# Altium schematic sheet CON_LCD_INDF.SchDoc: TFT LCD Header
size A4; Organization: Altium Limited.; Address1: Level 3, 12a Rodborough Rd; Address2: Frenchs Forest 2086; Address3: NSW; Address4: AUSTRALIA; Revision: 6; SheetNumber: 48; SheetTotal: 64
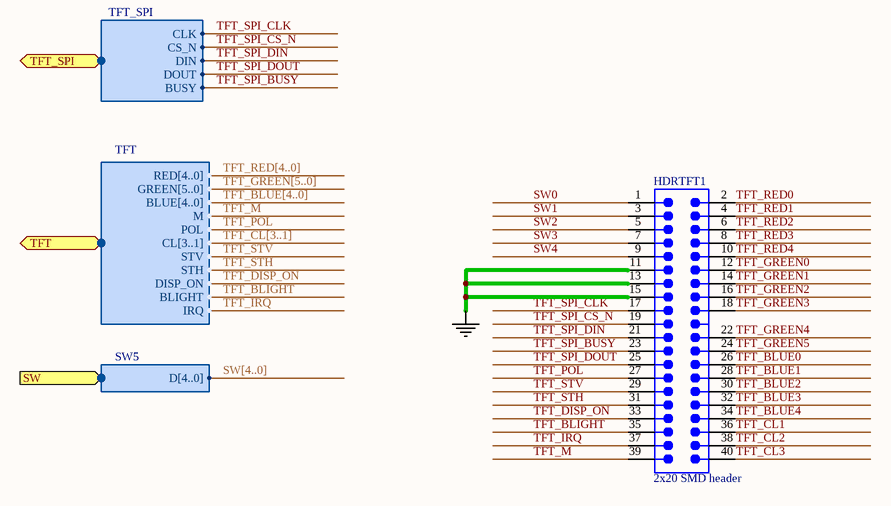
[diagram p0: CON_LCD_INDF.SchDoc]

## Parts
HDRTFT1  2x20 SMD header  [HDR2X20_SMT]

## Ports
SW (harness SW5), TFT (harness TFT), TFT_SPI (harness TFT_SPI)

## Harnesses
TFT_SPI: CLK, CS_N, DIN, DOUT, BUSY
TFT: IRQ, BLIGHT, POL, DISP_ON, STV, STH, M, CL[3..1], RED[4..0], GREEN[5..0], BLUE[4..0]
SW5: D[4..0]

## Nets
GND: HDRTFT1.11 HDRTFT1.13 HDRTFT1.15
SW0: HDRTFT1.1
SW1: HDRTFT1.3
SW2: HDRTFT1.5
SW3: HDRTFT1.7
SW4: HDRTFT1.9
TFT_BLIGHT: HDRTFT1.35 ; port TFT.BLIGHT
TFT_BLUE0: HDRTFT1.26
TFT_BLUE1: HDRTFT1.28
TFT_BLUE2: HDRTFT1.30
TFT_BLUE3: HDRTFT1.32
TFT_BLUE4: HDRTFT1.34
TFT_CL1: HDRTFT1.36
TFT_CL2: HDRTFT1.38
TFT_CL3: HDRTFT1.40
TFT_DISP_ON: HDRTFT1.33 ; port TFT.DISP_ON
TFT_GREEN0: HDRTFT1.12
TFT_GREEN1: HDRTFT1.14
TFT_GREEN2: HDRTFT1.16
TFT_GREEN3: HDRTFT1.18
TFT_GREEN4: HDRTFT1.22
TFT_GREEN5: HDRTFT1.24
TFT_IRQ: HDRTFT1.37 ; port TFT.IRQ
TFT_M: HDRTFT1.39 ; port TFT.M
TFT_POL: HDRTFT1.27 ; port TFT.POL
TFT_RED0: HDRTFT1.2
TFT_RED1: HDRTFT1.4
TFT_RED2: HDRTFT1.6
TFT_RED3: HDRTFT1.8
TFT_RED4: HDRTFT1.10
TFT_SPI_BUSY: HDRTFT1.23 ; port TFT_SPI.BUSY
TFT_SPI_CLK: HDRTFT1.17 ; port TFT_SPI.CLK
TFT_SPI_CS_N: HDRTFT1.19 ; port TFT_SPI.CS_N
TFT_SPI_DIN: HDRTFT1.21 ; port TFT_SPI.DIN
TFT_SPI_DOUT: HDRTFT1.25 ; port TFT_SPI.DOUT
TFT_STH: HDRTFT1.31 ; port TFT.STH
TFT_STV: HDRTFT1.29 ; port TFT.STV

## Buses and harness runs
bus SW[4..0]
bus TFT_BLUE[4..0]
bus TFT_CL[3..1]
bus TFT_GREEN[5..0]
bus TFT_RED[4..0]

## Notes on the sheet
- Sheet Title
- Project Title
- Size:
- Date:
- A4
- Assy:
- Time:
- Sheet
- Revision:
- of
- File:

## Library data of the parts
HDRTFT1 = D-300-0046: Header IDC, 2 x 20 pin SMD, Vertical; Max Current: mA; Connector type: Header; Mounting Technology: Surface Mount; Pin Count: 40; Status: Unreleased; Category: Connector